# Altium schematic sheet PressureSensor.SchDoc
size A4; SheetNumber: 7; SheetTotal: 8
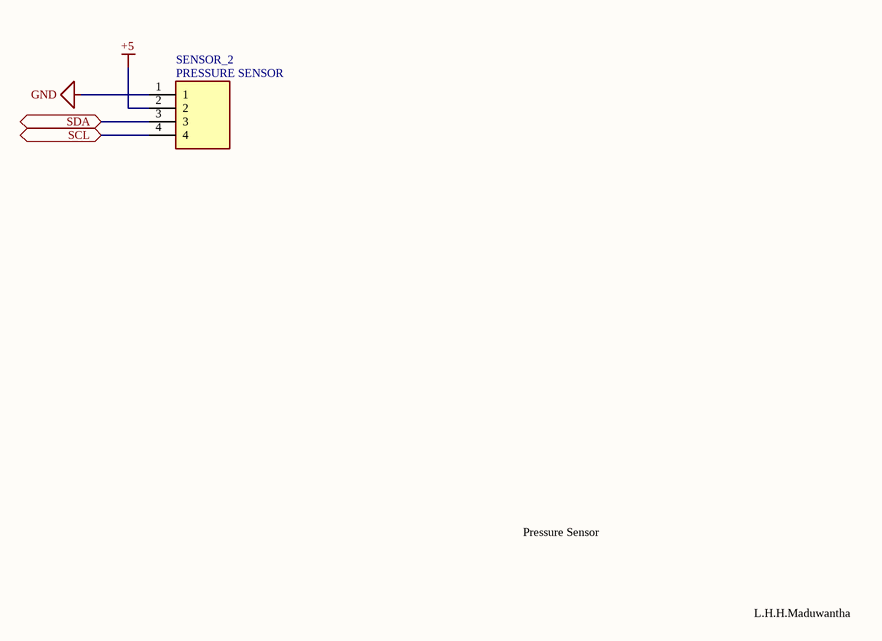
[diagram p0: PressureSensor.SchDoc]

## Parts
SENSOR_2  NAME: PRESSURE SENSOR  [B4BXHALFSN]  (hidden comment: B4B-XH-A_LF__SN_)

## Ports
SCL (bidir, see Main[3C], MCU[3C], UART_COM[2C]), SDA (bidir, see Main[3C], MCU[3C], UART_COM[2C])

## Nets
+5: SENSOR_2.2
GND: SENSOR_2.1
SCL: SENSOR_2.4 ; port SCL
SDA: SENSOR_2.3 ; port SDA

## Notes on the sheet
- Pressure Sensor
- L.H.H.Maduwantha

## Library data of the parts
SENSOR_2 = B4B-XH-A_LF__SN_: Connector; Manufacturer_Name: JST (JAPAN SOLDERLESS TERMINALS); Manufacturer_Part_Number: B4B-XH-A(LF)(SN); Datasheet Link: https://datasheet.lcsc.com/szlcsc/JST-Sales-America-B4B-XH-A-LF-SN_C144395.pdf; Height: 7mm; Arrow Part Number: B4B-XH-A(LF)(SN); Arrow Price/Stock: https://www.arrow.com/en/products/b4b-xh-a-lf-sn/jst-manufacturing?region=europe